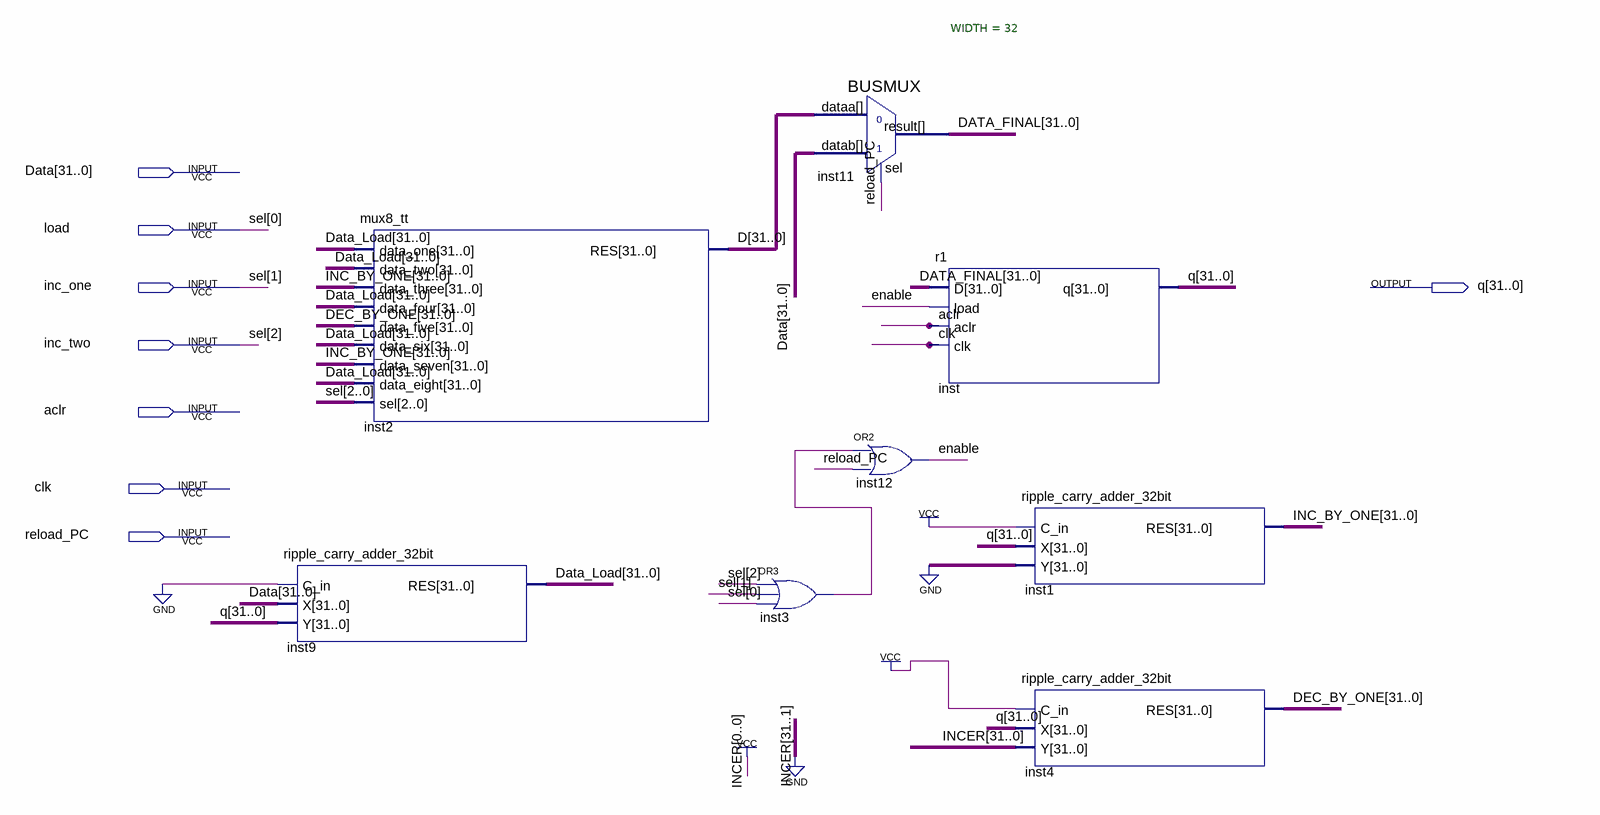
[diagram p0: schematic sheet]
// Quartus schematic r2.bdf as structural Verilog: 8 symbols, 8 pins
module r2 (
  input  [31:0] Data,
  input  load,
  input  inc_one,
  input  inc_two,
  input  aclr,
  input  clk,
  input  reload_PC,
  output [31:0] q
);

  wire enable, inst3_out;
  wire [31:0] D, DATA_FINAL, Data_Load, DEC_BY_ONE, INC_BY_ONE;

  ripple_carry_adder_32bit inst9 (.C_in(1'b0), .X(Data), .Y(q), .RES(Data_Load));
  mux8_tt inst2 (
    .data_one(Data_Load), .data_two(Data_Load), .data_three(INC_BY_ONE), .data_four(Data_Load),
    .data_five(DEC_BY_ONE), .data_six(Data_Load), .data_seven(INC_BY_ONE), .data_eight(Data_Load),
    .sel({inc_two, inc_one, load}), .RES(D));
  or inst3 (inst3_out, inc_two, inc_one, load);
  BUSMUX #(.WIDTH(32)) inst11 (.datab(Data), .sel(reload_PC), .dataa(D), .result(DATA_FINAL));
  or inst12 (enable, inst3_out, reload_PC);
  r1 inst (.D(DATA_FINAL), .load(enable), .aclr(aclr), .clk(clk), .q(q));
  ripple_carry_adder_32bit inst1 (.C_in(1'b1), .X(q), .Y({32{1'b0}}), .RES(INC_BY_ONE));
  ripple_carry_adder_32bit inst4 (.C_in(1'b1), .X(q), .Y(32'b00000000000000000000000000000001), .RES(DEC_BY_ONE));

  // Other names for the same wires on the sheet: sel[2:0] = {inc_two, inc_one, load}
endmodule
